# Altium schematic sheet Prog.SchDoc
size 381 x 241 mm
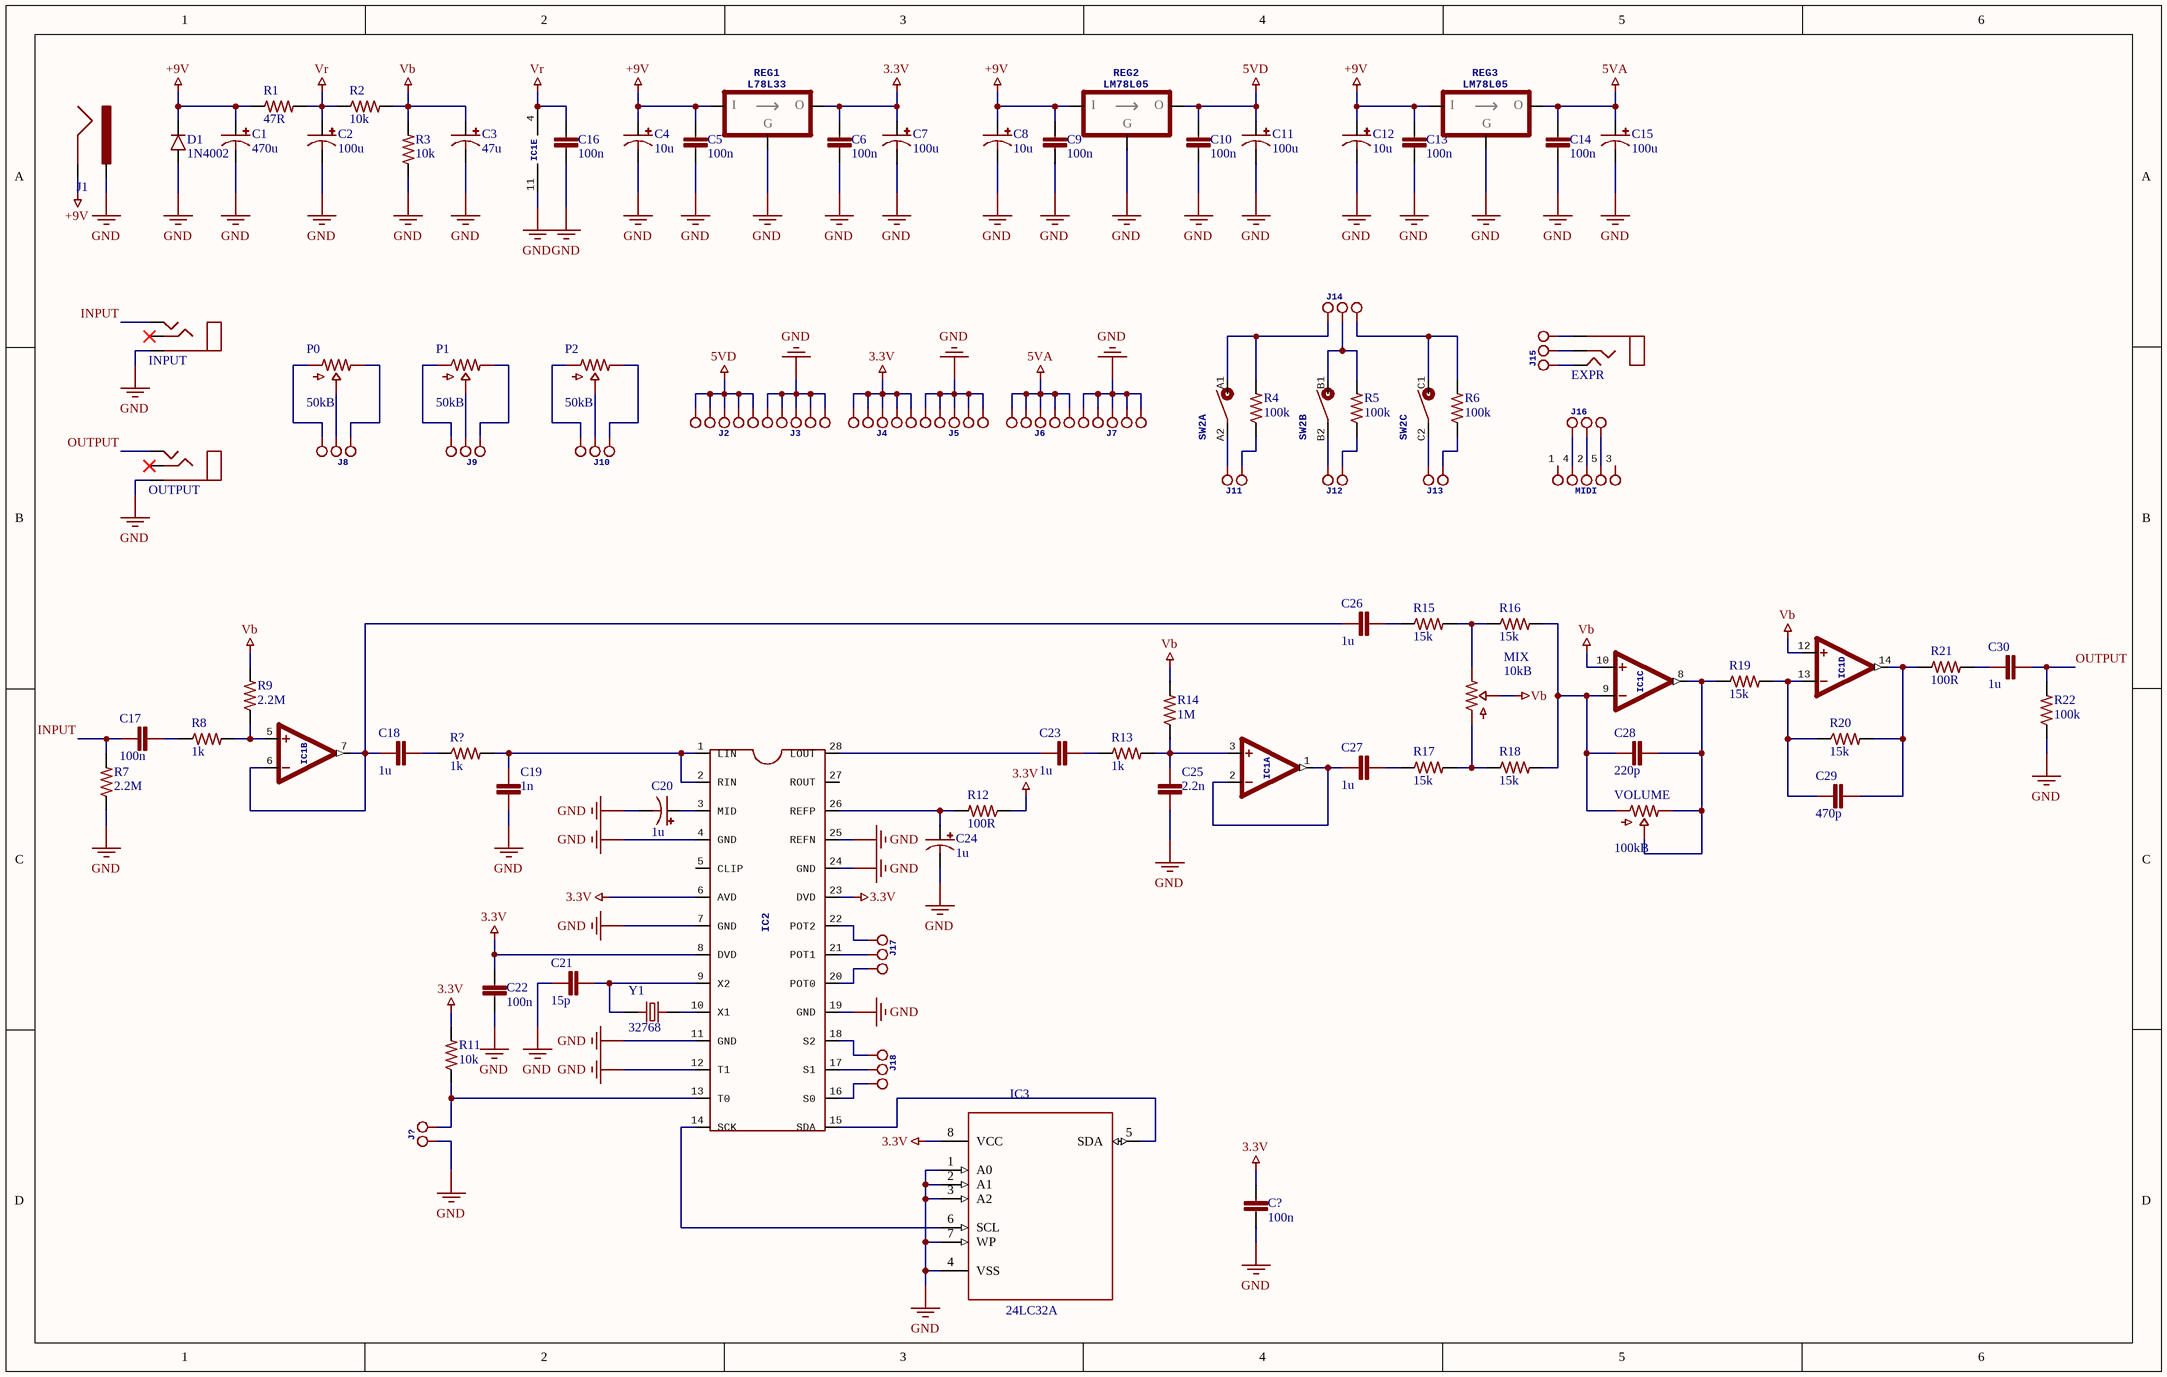
[diagram p0: Prog.SchDoc]

## Parts
C1  470u  [ELEC_080_040]
C2  100u  [ELEC_050_020]
C3  47u  [ELEC_050_020]
C4  10u  [ELEC_050_020]
C5  100n  [CER_050]
C6  100n  [CER_050]
C7  100u  [ELEC_050_020]
C8  10u  [ELEC_050_020]
C9  100n  [CER_050]
C10  100n  [CER_050]
C11  100u  [ELEC_050_020]
C12  10u  [ELEC_050_020]
C13  100n  [CER_050]
C14  100n  [CER_050]
C15  100u  [ELEC_050_020]
C16  100n  [CER_050]
C17  100n  [FILMBOX_SMALL]
C18  1u  [FILMBOX_BIG]
C19  1n  [FILMBOX_SMALL]
C20  1u  [ELEC_040_020]
C21  15p  [CER_050]
C22  100n  [CER_050]
C23  1u  [FILMBOX_BIG]
C24  1u  [ELEC_040_020]
C25  2.2n  [FILMBOX_SMALL]
C26  1u  [FILMBOX_BIG]
C27  1u  [FILMBOX_BIG]
C28  220p  [CER_050]
C29  470p  [CER_050]
C30  1u  [FILMBOX_BIG]
C?  100n  [CER_050]
D1  1N4002  [DO41_2]
EXPR  J_STEREO  [STEREO]  (value not drawn)
IC1  TL074  [DIL14]  (value not drawn)  (parts A,B,C,D,E of 5)
IC2  IC_FV-1  [SOIC28]  (value not drawn)
IC3  24LC32A  [DIL8]
INPUT  J_STEREO  [STEREO]  (value not drawn)
J1  J_DC_JACK  [DC_JACK]  (value not drawn)
J2  J_HEADER_5PINS_FEM  [HEADER_5Pins_FEM]  (value not drawn)
J3  J_HEADER_5PINS_FEM  [HEADER_5Pins_FEM]  (value not drawn)
J4  J_HEADER_5PINS_FEM  [HEADER_5Pins_FEM]  (value not drawn)
J5  J_HEADER_5PINS_FEM  [HEADER_5Pins_FEM]  (value not drawn)
J6  J_HEADER_5PINS_FEM  [HEADER_5Pins_FEM]  (value not drawn)
J7  J_HEADER_5PINS_FEM  [HEADER_5Pins_FEM]  (value not drawn)
J8  J_HEADER_3PINS_FEM  [HEADER_3Pins_FEM]  (value not drawn)
J9  J_HEADER_3PINS_FEM  [HEADER_3Pins_FEM]  (value not drawn)
J10  J_HEADER_3PINS_FEM  [HEADER_3Pins_FEM]  (value not drawn)
J11  J_HEADER_2PINS_FEM  [HEADER_2Pins_FEM]  (value not drawn)
J12  J_HEADER_2PINS_FEM  [HEADER_2Pins_FEM]  (value not drawn)
J13  J_HEADER_2PINS_FEM  [HEADER_2Pins_FEM]  (value not drawn)
J14  J_HEADER_3PINS_FEM  [HEADER_3Pins_FEM]  (value not drawn)
J15  J_HEADER_3PINS_FEM  [HEADER_3Pins_FEM]  (value not drawn)
J16  J_HEADER_3PINS_FEM  [HEADER_3Pins_FEM]  (value not drawn)
J17  J_HEADER_3PINS_FEM  [HEADER_3Pins_FEM]  (value not drawn)
J18  J_HEADER_3PINS_FEM  [HEADER_3Pins_FEM]  (value not drawn)
J?  J_HEADER_2PINS  [HEADER_2PINS]  (value not drawn)
MIDI  J_DIN_5PINS  [DIN_5PINS]  (value not drawn)
MIX  10kB  [ALPHA_9MM_TRIM_TOP]
OUTPUT  J_STEREO  [STEREO]  (value not drawn)
P0  50kB  [ALPHA_9MM_TRIM_TOP]
P1  50kB  [ALPHA_9MM_TRIM_TOP]
P2  50kB  [ALPHA_9MM_TRIM_TOP]
R1  47R  [R_3_47R_025W]
R2  10k  [R_3_10k_025W]
R3  10k  [R_3_10k_025W]
R4  100k  [R_3_100k_025W]
R5  100k  [R_3_100k_025W]
R6  100k  [R_3_100k_025W]
R7  2.2M  [R_3_2,2M_025W]
R8  1k  [R_3_1k_025W]
R9  2.2M  [R_3_2,2M_025W]
R11  10k  [R_3_10k_025W]
R12  100R  [R_3_100R_025W]
R13  1k  [R_3_1k_025W]
R14  1M  [R_3_1M_025W]
R15  15k  [R_3_15k_025W]
R16  15k  [R_3_15k_025W]
R17  15k  [R_3_15k_025W]
R18  15k  [R_3_15k_025W]
R19  15k  [R_3_15k_025W]
R20  15k  [R_3_15k_025W]
R21  100R  [R_3_100R_025W]
R22  100k  [R_3_100k_025W]
R?  1k  [R_3_1k_025W]
REG1  L78L33  [TO92]
REG2  LM78L05  [TO92]
REG3  LM78L05  [TO92]
SW2  DIP  [DIP_3WAY]  (value not drawn)  (parts A,B,C of 3)
VOLUME  100kB  [ALPHA_9MM_TRIM_TOP]
Y1  32768  [CYL]

## Nets
3.3V: C6.1 C7.+ C22.1 C?.1 IC2.6(AVD) IC2.8(DVD) IC2.23(DVD) IC3.8(VCC) J4.1 J4.2 J4.3 J4.4 J4.5 R11.2 R12.1 REG1.3(VI)
5VA: C14.1 C15.+ J6.1 J6.2 J6.3 J6.4 J6.5 REG3.3(VO)
5VD: C10.1 C11.+ J2.1 J2.2 J2.3 J2.4 J2.5 REG2.3(VO)
+9V: C1.+ C4.+ C5.1 C8.+ C9.1 C12.+ C13.1 D1.C J1.GND R1.1 REG1.1(VO) REG2.1(VI) REG3.1(VI)
GND: C1.- C2.- C3.- C4.- C5.2 C6.2 C7.- C8.- C9.2 C10.2 C11.- C12.- C13.2 C14.2 C15.- C16.2 C19.2 C20.- C21.2 C22.2 C24.- C25.2 C?.2 D1.A IC1.11(V-) IC2.4(GND) IC2.7(GND) IC2.11(GND) IC2.12(T1) IC2.19(GND) IC2.24(GND) IC2.25(REFN) IC3.1(A0) IC3.2(A1) IC3.3(A2) IC3.4(VSS) IC3.7(WP) INPUT.S J1.PWR J3.1 J3.2 J3.3 J3.4 J3.5 J5.1 J5.2 J5.3 J5.4 J5.5 J7.1 J7.2 J7.3 J7.4 J7.5 J?.2 OUTPUT.S R3.1 R7.1 R22.1 REG1.2(GND) REG2.2(GND) REG3.2(GND)
Vb: C3.+ IC1.10(+IN) IC1.12(+IN) MIX.2 R2.2 R3.2 R9.2 R14.2
Vr: C2.+ C16.1 IC1.4(V+) R1.2 R2.1
INPUT: C17.1 INPUT.T R7.2
OUTPUT: C30.1 OUTPUT.T R22.2
NetC17_2: C17.2 R8.1
NetC18_1: C18.1 R?.1
NetC18_2: C18.2 C26.2 IC1.6(-IN) IC1.7(OUT)
NetC19_1: C19.1 IC2.1(LIN) IC2.2(RIN) R?.2
NetC20_+: C20.+ IC2.3(MID)
NetC21_1: C21.1 IC2.9(X2) Y1.1
NetC23_1: C23.1 R13.1
NetC23_2: C23.2 IC2.28(LOUT)
NetC24_+: C24.+ IC2.26(REFP) R12.2
NetC25_1: C25.1 IC1.3(+IN) R13.2 R14.1
NetC26_1: C26.1 R15.1
NetC27_1: C27.1 R17.1
NetC27_2: C27.2 IC1.1(OUT) IC1.2(-IN)
NetC28_1: C28.1 IC1.8(OUT) R19.1 VOLUME.2 VOLUME.3
NetC28_2: C28.2 IC1.9(-IN) R16.2 R18.2 VOLUME.1
NetC29_1: C29.1 IC1.14(OUT) R20.2 R21.1
NetC29_2: C29.2 IC1.13(-IN) R19.2 R20.1
NetC30_2: C30.2 R21.2
NetEXPR_R: EXPR.R J15.2
NetEXPR_S: EXPR.S J15.1
NetEXPR_T: EXPR.T J15.3
NetIC1_5: IC1.5(+IN) R8.2 R9.1
NetIC2_10: IC2.10(X1) Y1.2
NetIC2_13: IC2.13(T0) J?.1 R11.1
NetIC2_14: IC2.14(SCK) IC3.6(SCL)
NetIC2_15: IC2.15(SDA) IC3.5(SDA)
NetIC2_16: IC2.16(S0) J18.1
NetIC2_17: IC2.17(S1) J18.2
NetIC2_18: IC2.18(S2) J18.3
NetIC2_20: IC2.20(POT0) J17.1
NetIC2_21: IC2.21(POT1) J17.2
NetIC2_22: IC2.22(POT2) J17.3
NetJ8_1: J8.1 P0.1
NetJ8_2: J8.2 P0.2
NetJ8_3: J8.3 P0.3
NetJ9_1: J9.1 P1.1
NetJ9_2: J9.2 P1.2
NetJ9_3: J9.3 P1.3
NetJ10_1: J10.1 P2.1
NetJ10_2: J10.2 P2.2
NetJ10_3: J10.3 P2.3
NetJ11_1: J11.1 SW2.A2
NetJ11_2: J11.2 R4.1
NetJ12_1: J12.1 SW2.B2
NetJ12_2: J12.2 R5.1
NetJ13_1: J13.1 SW2.C2
NetJ13_2: J13.2 R6.1
NetJ14_1: J14.1 R6.2 SW2.C1
NetJ14_2: J14.2 R5.2 SW2.B1
NetJ14_3: J14.3 R4.2 SW2.A1
NetJ16_1: J16.1 MIDI.5
NetJ16_2: J16.2 MIDI.2
NetJ16_3: J16.3 MIDI.4
NetMIX_1: MIX.1 R17.2 R18.1
NetMIX_3: MIX.3 R15.2 R16.1

Not connected (* = marked no-connect by the designer): IC2 5(CLIP) 27(ROUT); INPUT R*; MIDI 1 3; OUTPUT R*

## Notes on the sheet
- (in symbol REG_L78L33) I; O; G
- (in symbol REG_LM78L05) I; O; G

## Library data of the parts
C1 = C_ELEC_470u_16V: 470u 16V electrolytic capacitor; PinSpacing: 4mm; Price: 0.02; Dimensions: 8x12mm; Package: Radial
C2 C7 C11 C15 = C_ELEC_100u_16V: 100u 16V electrolytic capacitor; PinSpacing: 2mm; Dimensions: 5x8mm; Package: Radial; Price: 0.02
C3 = C_ELEC_47u_25V: 47u 25V electrolytic capacitor; PinSpacing: 2mm; Dimensions: 5x8mm; Package: Radial; Price: 0.02
C4 C8 C12 = C_ELEC_10u_50V: 10u 50V electrolytic capacitor; PinSpacing: 2mm; Price: 0.02; Dimensions: 4x8mm; Package: Radial
C5 C6 C9 C10 C13 C14 C16 C22 C? = C_CER_100n: 100n MLCC X7R radial capacitor; PinSpacing: 5.08mm; Price: 0.02; Package: Radial
C17 = C_FILMBOX_100n: 100n 100V polyester film box capacitor; PinSpacing: 5.08mm; Price: 0.05; Dimensions: 7.2x2.5x6.5mm; Package: Radial
C18 C23 C26 C27 C30 = C_FILMBOX_1u: 1u 100V polyester film box capacitor; PinSpacing: 5.08mm; Price: 0.1; Dimensions: 7.2x6x11mm; Package: Radial
C19 = C_FILMBOX_1n: 1n 100V polyester film box capacitor; PinSpacing: 5.08mm; Price: 0.05; Dimensions: 7.2x2.5x6.5mm; Package: Radial
C20 C24 = C_ELEC_1u_50V: 1u 50V electrolytic capacitor; PinSpacing: 2mm; Price: 0.02; Dimensions: 4x8mm; Package: Radial
C21 = C_CER_15p: 15p MLCC X7R radial capacitor; PinSpacing: 5.08mm; Price: 0.01; Package: Radial
C25 = C_FILMBOX_2.2n: 2.2n 100V polyester film box capacitor; PinSpacing: 5.08mm; Price: 0.05; Dimensions: 7.2x2.5x6.5mm; Package: Radial
C28 = C_CER_220p: 220p MLCC X7R radial capacitor; PinSpacing: 5.08mm; Price: 0.01; Package: Radial
C29 = C_CER_470p: 470p MLCC X7R radial capacitor; PinSpacing: 5.08mm; Price: 0.01; Package: Radial
D1 = D_1N4002: PinSpacing: 7.62mm; Package: DO-41; Price: 0.01
EXPR INPUT OUTPUT = J_STEREO: 6.35mm stereo insulated socket jack PCB mounted; Price: 0.5
IC1 = IC_TL074: Package: DIP-24; Price: 0.15
IC2 = IC_FV-1: Spinsemi FV-1; Package: SOIC-28; Price: 8
IC3 = IC_24LC32A: 32Kbit Serial IC I2C Serial EEPROM; Package: DIP-8; Price: 0.5
J1 = J_DC_JACK: DC Power jack 2.1mm barrel; Price: 0.05
J2-J7 = J_HEADER_5PINS_FEM: 5 Pins female header; Pin spacing: 2.54mm; Price: 0.01
J8-J10 J14-J18 = J_HEADER_3PINS_FEM: 3 Pins female header; Pin spacing: 2.54mm; Price: 0.01
J11-J13 = J_HEADER_2PINS_FEM: 2 Pins female header; Pin spacing: 2.54mm; Price: 0.01
J? = J_HEADER_2PINS: 2 Pins male header; Pin spacing: 2.54mm; Price: 0.01
MIDI = J_DIN_5PINS: 5 Pins DIN female connector; Pin spacing: 2.54mm; Price: 0.01
MIX = POT_10kB_ALPHA_9mm_TRIM: 10k Lin potentiometer trimmer; Price: 1.3; Dimensions: 9mm; Package: PCB Mounted
P0-P2 = POT_50kB_ALPHA_9mm_TRIM: 50k Lin potentiometer trimmer; Price: 1.3; Dimensions: 9mm; Package: PCB Mounted
R1 = R_3_47R_025W: 47R metal film 1/4W Resistor; PinSpacing: 7.62mm; Price: 0.01
R2 R3 R11 = R_3_10k_025W: 10k metal film 1/4W Resistor; PinSpacing: 7.62mm; Price: 0.01
R4-R6 R22 = R_3_100k_025W: 100k metal film 1/4W Resistor; PinSpacing: 7.62mm; Price: 0.01
R7 R9 = R_3_2.2M_025W: 2.2M metal film 1/4W Resistor; PinSpacing: 7.62mm; Price: 0.01
R8 R13 R? = R_3_1k_025W: 1k metal film 1/4W Resistor; PinSpacing: 7.62mm; Price: 0.01
R12 R21 = R_3_100R_025W: 100R metal film 1/4W Resistor; PinSpacing: 7.62mm; Price: 0.01
R14 = R_3_1M_025W: 1M metal film 1/4W Resistor; PinSpacing: 7.62mm; Price: 0.01
R15-R20 = R_3_15k_025W: 15k metal film 1/4W Resistor; PinSpacing: 7.62mm; Price: 0.01
REG1 = REG_L78L33: Price: 0.90; Package: TO-92
REG2 REG3 = REG_LM78L05: 78L05; Price: 0.01; Package: TO-92
SW2 = SW_DIP_3WAY: DIP Switch 3 way; Price: 0.1
VOLUME = POT_100kB_ALPHA_9mm_TRIM: 100k Lin potentiometer trimmer; Price: 1.3; Dimensions: 9mm; Package: PCB Mounted
Y1 = Y_32768k: 32768k Crystal; MP: ECS-40-18-10X; MF: ECS Inc.; SnapEDA_Link: https://www.snapeda.com/parts/ECS-40-18-10X/ECS%20Inc./view-part/?ref=snap; Price: None; Availability: Unavailable; Package: Cylindrical Can Radial  ECS International; Value: *